# Altium project PT1000_16CH.PrjPCB (part 5 of 5)

## Sheet Adapters.SchDoc: various
size 420 x 297 mm; Author: G.Kasprowicz; CompanyName: WUT ISE; DrawnBy: G.Kasprowicz; Organization: WUT ISE; Address1: PW ISE; Address2: Nowowiejska 15/19 00-665 Warsaw; Address3: gkasprow@gmail.com; DocumentNumber: 5; Revision: 2; SheetNumber: 5; SheetTotal: 5; ModifiedBy: -; CheckedDate: -; Title2: adapters; DivGrp: WUT ISE; Designer: G.Kasprowicz; ModifiedDate: -; ProjectName: Sensor Box
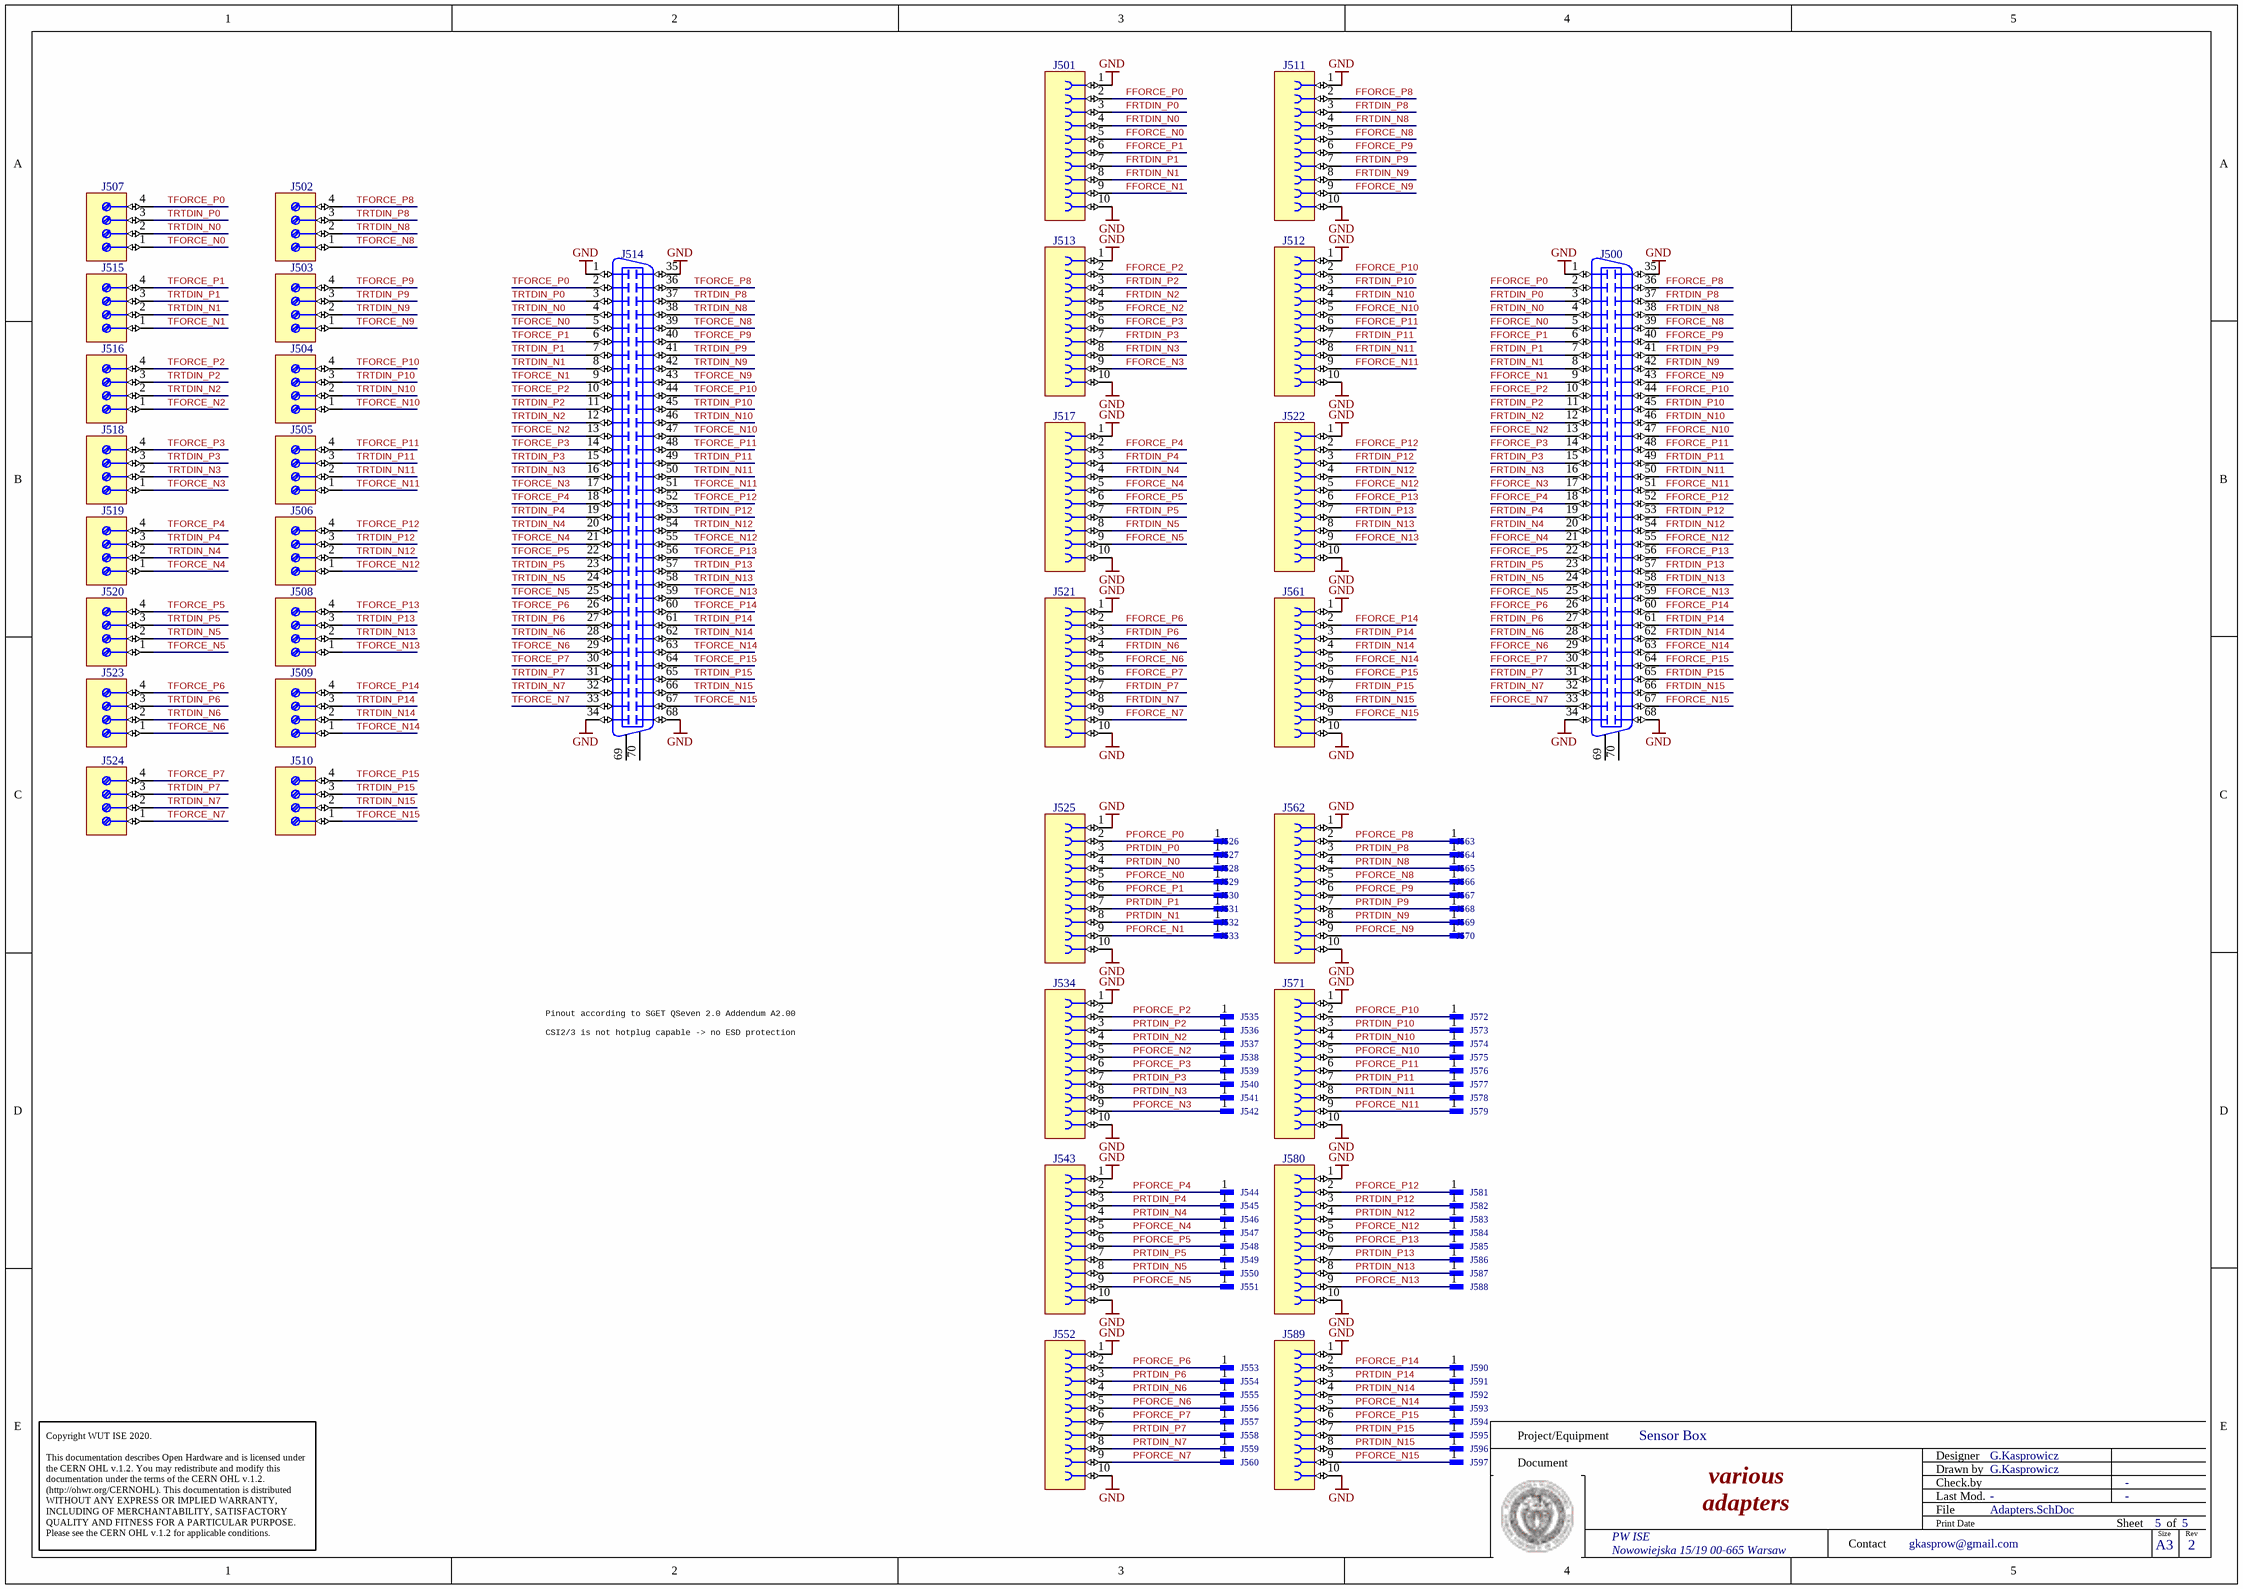
[diagram p7: Adapters.SchDoc]

### Parts
J500  DNP  [MOLEX_71430-0013]  (value not drawn)
J501  FFC/FPC  [MOLEX_52745-1097]  (value not drawn)
J502  (no value)  [PHOENIX_1725672]
J503  (no value)  [PHOENIX_1725672]
J504  (no value)  [PHOENIX_1725672]
J505  (no value)  [PHOENIX_1725672]
J506  (no value)  [PHOENIX_1725672]
J507  (no value)  [PHOENIX_1725672]
J508  (no value)  [PHOENIX_1725672]
J509  (no value)  [PHOENIX_1725672]
J510  (no value)  [PHOENIX_1725672]
J511  FFC/FPC  [MOLEX_52745-1097]  (value not drawn)
J512  FFC/FPC  [MOLEX_52745-1097]  (value not drawn)
J513  FFC/FPC  [MOLEX_52745-1097]  (value not drawn)
J514  DNP  [MOLEX_71430-0013]  (value not drawn)
J515  (no value)  [PHOENIX_1725672]
J516  (no value)  [PHOENIX_1725672]
J517  FFC/FPC  [MOLEX_52745-1097]  (value not drawn)
J518  (no value)  [PHOENIX_1725672]
J519  (no value)  [PHOENIX_1725672]
J520  (no value)  [PHOENIX_1725672]
J521  FFC/FPC  [MOLEX_52745-1097]  (value not drawn)
J522  FFC/FPC  [MOLEX_52745-1097]  (value not drawn)
J523  (no value)  [PHOENIX_1725672]
J524  (no value)  [PHOENIX_1725672]
J525  FFC/FPC  [MOLEX_52745-1097]  (value not drawn)
J526  SMD Pad  [R350X200]  (value not drawn)
J527  SMD Pad  [R350X200]  (value not drawn)
J528  SMD Pad  [R350X200]  (value not drawn)
J529  SMD Pad  [R350X200]  (value not drawn)
J530  SMD Pad  [R350X200]  (value not drawn)
J531  SMD Pad  [R350X200]  (value not drawn)
J532  SMD Pad  [R350X200]  (value not drawn)
J533  SMD Pad  [R350X200]  (value not drawn)
J534  FFC/FPC  [MOLEX_52745-1097]  (value not drawn)
J535  SMD Pad  [R350X200]  (value not drawn)
J536  SMD Pad  [R350X200]  (value not drawn)
J537  SMD Pad  [R350X200]  (value not drawn)
J538  SMD Pad  [R350X200]  (value not drawn)
J539  SMD Pad  [R350X200]  (value not drawn)
J540  SMD Pad  [R350X200]  (value not drawn)
J541  SMD Pad  [R350X200]  (value not drawn)
J542  SMD Pad  [R350X200]  (value not drawn)
J543  FFC/FPC  [MOLEX_52745-1097]  (value not drawn)
J544  SMD Pad  [R350X200]  (value not drawn)
J545  SMD Pad  [R350X200]  (value not drawn)
J546  SMD Pad  [R350X200]  (value not drawn)
J547  SMD Pad  [R350X200]  (value not drawn)
J548  SMD Pad  [R350X200]  (value not drawn)
J549  SMD Pad  [R350X200]  (value not drawn)
J550  SMD Pad  [R350X200]  (value not drawn)
J551  SMD Pad  [R350X200]  (value not drawn)
J552  FFC/FPC  [MOLEX_52745-1097]  (value not drawn)
J553  SMD Pad  [R350X200]  (value not drawn)
J554  SMD Pad  [R350X200]  (value not drawn)
J555  SMD Pad  [R350X200]  (value not drawn)
J556  SMD Pad  [R350X200]  (value not drawn)
J557  SMD Pad  [R350X200]  (value not drawn)
J558  SMD Pad  [R350X200]  (value not drawn)
J559  SMD Pad  [R350X200]  (value not drawn)
J560  SMD Pad  [R350X200]  (value not drawn)
J561  FFC/FPC  [MOLEX_52745-1097]  (value not drawn)
J562  FFC/FPC  [MOLEX_52745-1097]  (value not drawn)
J563  SMD Pad  [R350X200]  (value not drawn)
J564  SMD Pad  [R350X200]  (value not drawn)
J565  SMD Pad  [R350X200]  (value not drawn)
J566  SMD Pad  [R350X200]  (value not drawn)
J567  SMD Pad  [R350X200]  (value not drawn)
J568  SMD Pad  [R350X200]  (value not drawn)
J569  SMD Pad  [R350X200]  (value not drawn)
J570  SMD Pad  [R350X200]  (value not drawn)
J571  FFC/FPC  [MOLEX_52745-1097]  (value not drawn)
J572  SMD Pad  [R350X200]  (value not drawn)
J573  SMD Pad  [R350X200]  (value not drawn)
J574  SMD Pad  [R350X200]  (value not drawn)
J575  SMD Pad  [R350X200]  (value not drawn)
J576  SMD Pad  [R350X200]  (value not drawn)
J577  SMD Pad  [R350X200]  (value not drawn)
J578  SMD Pad  [R350X200]  (value not drawn)
J579  SMD Pad  [R350X200]  (value not drawn)
J580  FFC/FPC  [MOLEX_52745-1097]  (value not drawn)
J581  SMD Pad  [R350X200]  (value not drawn)
J582  SMD Pad  [R350X200]  (value not drawn)
J583  SMD Pad  [R350X200]  (value not drawn)
J584  SMD Pad  [R350X200]  (value not drawn)
J585  SMD Pad  [R350X200]  (value not drawn)
J586  SMD Pad  [R350X200]  (value not drawn)
J587  SMD Pad  [R350X200]  (value not drawn)
J588  SMD Pad  [R350X200]  (value not drawn)
J589  FFC/FPC  [MOLEX_52745-1097]  (value not drawn)
J590  SMD Pad  [R350X200]  (value not drawn)
J591  SMD Pad  [R350X200]  (value not drawn)
J592  SMD Pad  [R350X200]  (value not drawn)
J593  SMD Pad  [R350X200]  (value not drawn)
J594  SMD Pad  [R350X200]  (value not drawn)
J595  SMD Pad  [R350X200]  (value not drawn)
J596  SMD Pad  [R350X200]  (value not drawn)
J597  SMD Pad  [R350X200]  (value not drawn)

### Nets
GND: J500.1 J500.34 J500.35 J500.68 J501.1 J501.10 J511.1 J511.10 J512.1 J512.10 J513.1 J513.10 J514.1 J514.34 J514.35 J514.68 J517.1 J517.10 J521.1 J521.10 J522.1 J522.10 J525.1 J525.10 J534.1 J534.10 J543.1 J543.10 J552.1 J552.10 J561.1 J561.10 J562.1 J562.10 J571.1 J571.10 J580.1 J580.10 J589.1 J589.10
FFORCE_N0: J500.5 J501.5
FFORCE_N1: J500.9 J501.9
FFORCE_N2: J500.13 J513.5
FFORCE_N3: J500.17 J513.9
FFORCE_N4: J500.21 J517.5
FFORCE_N5: J500.25 J517.9
FFORCE_N6: J500.29 J521.5
FFORCE_N7: J500.33 J521.9
FFORCE_N8: J500.39 J511.5
FFORCE_N9: J500.43 J511.9
FFORCE_N10: J500.47 J512.5
FFORCE_N11: J500.51 J512.9
FFORCE_N12: J500.55 J522.5
FFORCE_N13: J500.59 J522.9
FFORCE_N14: J500.63 J561.5
FFORCE_N15: J500.67 J561.9
FFORCE_P0: J500.2 J501.2
FFORCE_P1: J500.6 J501.6
FFORCE_P2: J500.10 J513.2
FFORCE_P3: J500.14 J513.6
FFORCE_P4: J500.18 J517.2
FFORCE_P5: J500.22 J517.6
FFORCE_P6: J500.26 J521.2
FFORCE_P7: J500.30 J521.6
FFORCE_P8: J500.36 J511.2
FFORCE_P9: J500.40 J511.6
FFORCE_P10: J500.44 J512.2
FFORCE_P11: J500.48 J512.6
FFORCE_P12: J500.52 J522.2
FFORCE_P13: J500.56 J522.6
FFORCE_P14: J500.60 J561.2
FFORCE_P15: J500.64 J561.6
FRTDIN_N0: J500.4 J501.4
FRTDIN_N1: J500.8 J501.8
FRTDIN_N2: J500.12 J513.4
FRTDIN_N3: J500.16 J513.8
FRTDIN_N4: J500.20 J517.4
FRTDIN_N5: J500.24 J517.8
FRTDIN_N6: J500.28 J521.4
FRTDIN_N7: J500.32 J521.8
FRTDIN_N8: J500.38 J511.4
FRTDIN_N9: J500.42 J511.8
FRTDIN_N10: J500.46 J512.4
FRTDIN_N11: J500.50 J512.8
FRTDIN_N12: J500.54 J522.4
FRTDIN_N13: J500.58 J522.8
FRTDIN_N14: J500.62 J561.4
FRTDIN_N15: J500.66 J561.8
FRTDIN_P0: J500.3 J501.3
FRTDIN_P1: J500.7 J501.7
FRTDIN_P2: J500.11 J513.3
FRTDIN_P3: J500.15 J513.7
FRTDIN_P4: J500.19 J517.3
FRTDIN_P5: J500.23 J517.7
FRTDIN_P6: J500.27 J521.3
FRTDIN_P7: J500.31 J521.7
FRTDIN_P8: J500.37 J511.3
FRTDIN_P9: J500.41 J511.7
FRTDIN_P10: J500.45 J512.3
FRTDIN_P11: J500.49 J512.7
FRTDIN_P12: J500.53 J522.3
FRTDIN_P13: J500.57 J522.7
FRTDIN_P14: J500.61 J561.3
FRTDIN_P15: J500.65 J561.7
PFORCE_N0: J525.5 J529.1
PFORCE_N1: J525.9 J533.1
PFORCE_N2: J534.5 J538.1
PFORCE_N3: J534.9 J542.1
PFORCE_N4: J543.5 J547.1
PFORCE_N5: J543.9 J551.1
PFORCE_N6: J552.5 J556.1
PFORCE_N7: J552.9 J560.1
PFORCE_N8: J562.5 J566.1
PFORCE_N9: J562.9 J570.1
PFORCE_N10: J571.5 J575.1
PFORCE_N11: J571.9 J579.1
PFORCE_N12: J580.5 J584.1
PFORCE_N13: J580.9 J588.1
PFORCE_N14: J589.5 J593.1
PFORCE_N15: J589.9 J597.1
PFORCE_P0: J525.2 J526.1
PFORCE_P1: J525.6 J530.1
PFORCE_P2: J534.2 J535.1
PFORCE_P3: J534.6 J539.1
PFORCE_P4: J543.2 J544.1
PFORCE_P5: J543.6 J548.1
PFORCE_P6: J552.2 J553.1
PFORCE_P7: J552.6 J557.1
PFORCE_P8: J562.2 J563.1
PFORCE_P9: J562.6 J567.1
PFORCE_P10: J571.2 J572.1
PFORCE_P11: J571.6 J576.1
PFORCE_P12: J580.2 J581.1
PFORCE_P13: J580.6 J585.1
PFORCE_P14: J589.2 J590.1
PFORCE_P15: J589.6 J594.1
PRTDIN_N0: J525.4 J528.1
PRTDIN_N1: J525.8 J532.1
PRTDIN_N2: J534.4 J537.1
PRTDIN_N3: J534.8 J541.1
PRTDIN_N4: J543.4 J546.1
PRTDIN_N5: J543.8 J550.1
PRTDIN_N6: J552.4 J555.1
PRTDIN_N7: J552.8 J559.1
PRTDIN_N8: J562.4 J565.1
PRTDIN_N9: J562.8 J569.1
PRTDIN_N10: J571.4 J574.1
PRTDIN_N11: J571.8 J578.1
PRTDIN_N12: J580.4 J583.1
PRTDIN_N13: J580.8 J587.1
PRTDIN_N14: J589.4 J592.1
PRTDIN_N15: J589.8 J596.1
PRTDIN_P0: J525.3 J527.1
PRTDIN_P1: J525.7 J531.1
PRTDIN_P2: J534.3 J536.1
PRTDIN_P3: J534.7 J540.1
PRTDIN_P4: J543.3 J545.1
PRTDIN_P5: J543.7 J549.1
PRTDIN_P6: J552.3 J554.1
PRTDIN_P7: J552.7 J558.1
PRTDIN_P8: J562.3 J564.1
PRTDIN_P9: J562.7 J568.1
PRTDIN_P10: J571.3 J573.1
PRTDIN_P11: J571.7 J577.1
PRTDIN_P12: J580.3 J582.1
PRTDIN_P13: J580.7 J586.1
PRTDIN_P14: J589.3 J591.1
PRTDIN_P15: J589.7 J595.1
TFORCE_N0: J507.1 J514.5
TFORCE_N1: J514.9 J515.1
TFORCE_N2: J514.13 J516.1
TFORCE_N3: J514.17 J518.1
TFORCE_N4: J514.21 J519.1
TFORCE_N5: J514.25 J520.1
TFORCE_N6: J514.29 J523.1
TFORCE_N7: J514.33 J524.1
TFORCE_N8: J502.1 J514.39
TFORCE_N9: J503.1 J514.43
TFORCE_N10: J504.1 J514.47
TFORCE_N11: J505.1 J514.51
TFORCE_N12: J506.1 J514.55
TFORCE_N13: J508.1 J514.59
TFORCE_N14: J509.1 J514.63
TFORCE_N15: J510.1 J514.67
TFORCE_P0: J507.4 J514.2
TFORCE_P1: J514.6 J515.4
TFORCE_P2: J514.10 J516.4
TFORCE_P3: J514.14 J518.4
TFORCE_P4: J514.18 J519.4
TFORCE_P5: J514.22 J520.4
TFORCE_P6: J514.26 J523.4
TFORCE_P7: J514.30 J524.4
TFORCE_P8: J502.4 J514.36
TFORCE_P9: J503.4 J514.40
TFORCE_P10: J504.4 J514.44
TFORCE_P11: J505.4 J514.48
TFORCE_P12: J506.4 J514.52
TFORCE_P13: J508.4 J514.56
TFORCE_P14: J509.4 J514.60
TFORCE_P15: J510.4 J514.64
TRTDIN_N0: J507.2 J514.4
TRTDIN_N1: J514.8 J515.2
TRTDIN_N2: J514.12 J516.2
TRTDIN_N3: J514.16 J518.2
TRTDIN_N4: J514.20 J519.2
TRTDIN_N5: J514.24 J520.2
TRTDIN_N6: J514.28 J523.2
TRTDIN_N7: J514.32 J524.2
TRTDIN_N8: J502.2 J514.38
TRTDIN_N9: J503.2 J514.42
TRTDIN_N10: J504.2 J514.46
TRTDIN_N11: J505.2 J514.50
TRTDIN_N12: J506.2 J514.54
TRTDIN_N13: J508.2 J514.58
TRTDIN_N14: J509.2 J514.62
TRTDIN_N15: J510.2 J514.66
TRTDIN_P0: J507.3 J514.3
TRTDIN_P1: J514.7 J515.3
TRTDIN_P2: J514.11 J516.3
TRTDIN_P3: J514.15 J518.3
TRTDIN_P4: J514.19 J519.3
TRTDIN_P5: J514.23 J520.3
TRTDIN_P6: J514.27 J523.3
TRTDIN_P7: J514.31 J524.3
TRTDIN_P8: J502.3 J514.37
TRTDIN_P9: J503.3 J514.41
TRTDIN_P10: J504.3 J514.45
TRTDIN_P11: J505.3 J514.49
TRTDIN_P12: J506.3 J514.53
TRTDIN_P13: J508.3 J514.57
TRTDIN_P14: J509.3 J514.61
TRTDIN_P15: J510.3 J514.65

Not connected (* = marked no-connect by the designer): J500 69 70; J514 69 70

### Notes on the sheet
- Pinout according to SGET QSeven 2.0 Addendum A2.00
  CSI2/3 is not hotplug capable -> no ESD protection
- Project/Equipment
- Document
- Designer
- Drawn by
- Check.by
- Copyright WUT ISE 2020.
  This documentation describes Open Hardware and is licensed under the CERN OHL v.1.2. You may redistribute and modify this documentation under the terms of the CERN OHL v.1.2. (http://ohwr.org/CERNOHL). This documentation is distributed WITHOUT ANY EXPRESS OR IMPLIED WARRANTY, INCLUDING OF MERCHANTABILITY, SATISFACTORY QUALITY AND FITNESS FOR A PARTICULAR PURPOSE. Please see the CERN OHL v.1.2 for applicable conditions.
- Contact
- File
- Last Mod.
- Print Date
- Sheet
- Size
- A3
- of
- Rev

### Library data of the parts
J500 J514 = MOLEX_71430-0013: Very High Density Cable Interconnect (VHDCI ) 68 Female; Part Description: 68 Positions, Pitch 0.8mm, Very Hight Density Right Angle Receptacle, VHDCI Standard (Recommended PCB Thickness: 1.6mm); Manufacturer: MOLEX; PressFit: No; Part Number: MOLEX_71430-0013; Component Kind: Standard; Component Type: Standard; Pin Count: 70; Family: VHDCI; Mounted: Yes; Socket: No; SMD: No; Status: None; Manufacturer Part Number: 71430-0013; ComponentHeight: 6.28mm; HelpURL: \\cern.ch\dfs\Applications\Altium\Datasheets\MOLEX_71430-0013.pdf; Author: CERN DEM JLC; CreateDate: 2014-01-30; LatestRevisionDate: 2014-01-30; Table: MOLEX
J501 J511-J513 J517 J521 J522 J525 J534 J543 J552 J561 J562 J571 J580 J589 = MOLEX_52745-1097: Connector 10 Female; Part Description: 10 Contacts, 0.5mm Pitch, Right Angled Surface Mount FFC/FPC Connector, ZIF, Top Contact Style; Manufacturer: MOLEX; PressFit: No; Part Number: MOLEX_52745-1097; Component Kind: Standard; Component Type: Standard; Pin Count: 10; Family: FFC/FPC; Mounted: Yes; Socket: No; SMD: Yes; Sense: No; Status: None; Manufacturer Part Number: 52745-1097; ComponentHeight: 2mm; HelpURL: \\cern.ch\dfs\Applications\Altium\Datasheets\MOLEX_52745-1097.pdf; Author: CERN DEM JLC; CreateDate: 04/11/2014; LatestRevisionDate: 05/12/2014
J502-J510 J515 J516 J518-J520 J523 J524 = PHOENIX_1725672: Terminal Block, 4 Positions, Screw Connection; Part Description: 6A, 63V, Terminal Block, Pitch 2.54mm, 4 Positions, Screw Connection; Manufacturer: PHOENIX CONTACT; Manufacturer Part Number: 1725672 (MPT 0,5/4-2,54); PressFit: No; Part Number: PHOENIX_1725672; Component Kind: Standard; Component Type: Standard; Pin Count: 4; Mounted: Yes; Socket: No; SMD: No; Sense: No; Status: None; ComponentHeight: 8.5mm; HelpURL: \\cern.ch\dfs\Applications\Altium\Datasheets\PHOENIX_1725672.pdf; Author: CERN DEM JMW; CreateDate: 07.11.2008; LatestRevisionDate: 26.04.2010
J526-J533 J535-J542 J544-J551 J553-J560 J563-J570 J572-J579 J581-J588 J590-J597 = SMD_PAD_3.5X2MM: Single SMD Pad; Part Description: 3.5mm x 2mm SMD Pad; Mounted: No; Part Number: SMD_PAD_3.5X2MM; Component Kind: Standard (No BOM); Component Type: Standard (No BOM); Pin Count: 1; Family: SMD Pad; Socket: No; SMD: No; Sense: No; Status: None; ComponentHeight: 0mm; HelpURL: Undefined; Author: CERN DEM JLC; CreateDate: 15/03/2010; LatestRevisionDate: 15/03/2010; PackageDescription: 3.5mm x  2mm SMD Pad

## Nets that join several sheets
5V0_USB: USB (F1.2), Supply (D?#1.2)
GND: Thermostat_16CH (11 pins), MCU_STM32F4 (62 pins), RMII_Ethernet (24 pins), USB (11 pins), Supply (37 pins), EEM_DIOT_connector (61 pins), RTD_00 (8 pins), RTD_01 (8 pins), RTD_02 (8 pins), RTD_03 (8 pins), RTD_04 (8 pins), RTD_05 (8 pins), RTD_06 (8 pins), RTD_07 (8 pins), RTD_08 (8 pins), RTD_09 (8 pins), RTD_10 (8 pins), RTD_11 (8 pins), RTD_12 (8 pins), RTD_13 (8 pins), RTD_14 (8 pins), RTD_15 (8 pins), Adapters (40 pins)
P3V0REF: MCU_STM32F4 (R70.2), Supply (5 pins)
P3V3: Thermostat_16CH (D3.5 IC7.6 IC7.16 IC8.16), MCU_STM32F4 (48 pins), RMII_Ethernet (8 pins), Supply (10 pins), EEM_DIOT_connector (19 pins), RTD_00 (C224_1.1 C225_1.1 IC84_1.19 L2_1.2), RTD_01 (C224_2.1 C225_2.1 IC84_2.19 L2_2.2), RTD_02 (C224_3.1 C225_3.1 IC84_3.19 L2_3.2), RTD_03 (C224_4.1 C225_4.1 IC84_4.19 L2_4.2), RTD_04 (C224_5.1 C225_5.1 IC84_5.19 L2_5.2), RTD_05 (C224_6.1 C225_6.1 IC84_6.19 L2_6.2), RTD_06 (C224_7.1 C225_7.1 IC84_7.19 L2_7.2), RTD_07 (C224_8.1 C225_8.1 IC84_8.19 L2_8.2), RTD_08 (C224_9.1 C225_9.1 IC84_9.19 L2_9.2), RTD_09 (C224_10.1 C225_10.1 IC84_10.19 L2_10.2), RTD_10 (C224_11.1 C225_11.1 IC84_11.19 L2_11.2), RTD_11 (C224_12.1 C225_12.1 IC84_12.19 L2_12.2), RTD_12 (C224_13.1 C225_13.1 IC84_13.19 L2_13.2), RTD_13 (C224_14.1 C225_14.1 IC84_14.19 L2_14.2), RTD_14 (C224_15.1 C225_15.1 IC84_15.19 L2_15.2), RTD_15 (C224_16.1 C225_16.1 IC84_16.19 L2_16.2)
P3V3_MP: Supply (R10.1), EEM_DIOT_connector (10 pins)
P12V0: MCU_STM32F4 (R83.2), Supply (6 pins), EEM_DIOT_connector (7 pins)
P12V0_IN: Supply (11 pins), EEM_DIOT_connector (T9.1 T9.2 T9.3 T10.1)
AFE_SCL: Thermostat_16CH (D3.3 J1.68), MCU_STM32F4 (B15.1 IC9.11 R61.2)
AFE_SDA: Thermostat_16CH (D3.4 J1.34), MCU_STM32F4 (B14.1 IC9.10 R53.2)
AT_EVENT: MCU_STM32F4 (IC9.66), Supply (IC6.4 R67.1)
CPU_RESETn: MCU_STM32F4 (D5.1 IC13.2), Supply (T6.1)
FORCE_N00: Thermostat_16CH (J1.5), RTD_00 (IC84_1.9)
FORCE_N01: Thermostat_16CH (J1.9), RTD_01 (IC84_2.9)
FORCE_N02: Thermostat_16CH (J1.13), RTD_02 (IC84_3.9)
FORCE_N03: Thermostat_16CH (J1.17), RTD_03 (IC84_4.9)
FORCE_N04: Thermostat_16CH (J1.21), RTD_04 (IC84_5.9)
FORCE_N05: Thermostat_16CH (J1.25), RTD_05 (IC84_6.9)
FORCE_N06: Thermostat_16CH (J1.29), RTD_06 (IC84_7.9)
FORCE_N07: Thermostat_16CH (J1.33), RTD_07 (IC84_8.9)
FORCE_N08: Thermostat_16CH (J1.39), RTD_08 (IC84_9.9)
FORCE_N09: Thermostat_16CH (J1.43), RTD_09 (IC84_10.9)
FORCE_N10: Thermostat_16CH (J1.47), RTD_10 (IC84_11.9)
FORCE_N11: Thermostat_16CH (J1.51), RTD_11 (IC84_12.9)
FORCE_N12: Thermostat_16CH (J1.55), RTD_12 (IC84_13.9)
FORCE_N13: Thermostat_16CH (J1.59), RTD_13 (IC84_14.9)
FORCE_N14: Thermostat_16CH (J1.63), RTD_14 (IC84_15.9)
FORCE_N15: Thermostat_16CH (J1.67), RTD_15 (IC84_16.9)
FORCE_P00: Thermostat_16CH (J1.2), RTD_00 (IC84_1.5)
FORCE_P01: Thermostat_16CH (J1.6), RTD_01 (IC84_2.5)
FORCE_P02: Thermostat_16CH (J1.10), RTD_02 (IC84_3.5)
FORCE_P03: Thermostat_16CH (J1.14), RTD_03 (IC84_4.5)
FORCE_P04: Thermostat_16CH (J1.18), RTD_04 (IC84_5.5)
FORCE_P05: Thermostat_16CH (J1.22), RTD_05 (IC84_6.5)
FORCE_P06: Thermostat_16CH (J1.26), RTD_06 (IC84_7.5)
FORCE_P07: Thermostat_16CH (J1.30), RTD_07 (IC84_8.5)
FORCE_P08: Thermostat_16CH (J1.36), RTD_08 (IC84_9.5)
FORCE_P09: Thermostat_16CH (J1.40), RTD_09 (IC84_10.5)
FORCE_P10: Thermostat_16CH (J1.44), RTD_10 (IC84_11.5)
FORCE_P11: Thermostat_16CH (J1.48), RTD_11 (IC84_12.5)
FORCE_P12: Thermostat_16CH (J1.52), RTD_12 (IC84_13.5)
FORCE_P13: Thermostat_16CH (J1.56), RTD_13 (IC84_14.5)
FORCE_P14: Thermostat_16CH (J1.60), RTD_14 (IC84_15.5)
FORCE_P15: Thermostat_16CH (J1.64), RTD_15 (IC84_16.5)
I2C1_SCL: MCU_STM32F4 (IC9.139), EEM_DIOT_connector (5 pins)
I2C1_SDA: MCU_STM32F4 (IC9.140), EEM_DIOT_connector (5 pins)
I_meas_P12V0: MCU_STM32F4 (IC9.20), Supply (C89.1 R141.2)
MAX_CH_A0: Thermostat_16CH (IC7.1 IC8.1 R42.1), MCU_STM32F4 (IC9.141)
MAX_CH_A1: Thermostat_16CH (IC7.2 IC8.2 R43.1), MCU_STM32F4 (IC9.142)
MAX_CH_A2: Thermostat_16CH (IC7.3 IC8.3 R44.1), MCU_STM32F4 (IC9.1)
MAX_CH_A3: Thermostat_16CH (IC7.5 IC8.6 R46.1), MCU_STM32F4 (IC9.2)
MAX_CS00: Thermostat_16CH (IC7.15), RTD_00 (IC84_1.13)
MAX_CS01: Thermostat_16CH (IC7.14), RTD_01 (IC84_2.13)
MAX_CS02: Thermostat_16CH (IC7.13), RTD_02 (IC84_3.13)
MAX_CS03: Thermostat_16CH (IC7.12), RTD_03 (IC84_4.13)
MAX_CS04: Thermostat_16CH (IC7.11), RTD_04 (IC84_5.13)
MAX_CS05: Thermostat_16CH (IC7.10), RTD_05 (IC84_6.13)
MAX_CS06: Thermostat_16CH (IC7.9), RTD_06 (IC84_7.13)
MAX_CS07: Thermostat_16CH (IC7.7), RTD_07 (IC84_8.13)
MAX_CS08: Thermostat_16CH (IC8.15), RTD_08 (IC84_9.13)
MAX_CS09: Thermostat_16CH (IC8.14), RTD_09 (IC84_10.13)
MAX_CS10: Thermostat_16CH (IC8.13), RTD_10 (IC84_11.13)
MAX_CS11: Thermostat_16CH (IC8.12), RTD_11 (IC84_12.13)
MAX_CS12: Thermostat_16CH (IC8.11), RTD_12 (IC84_13.13)
MAX_CS13: Thermostat_16CH (IC8.10), RTD_13 (IC84_14.13)
MAX_CS14: Thermostat_16CH (IC8.9), RTD_14 (IC84_15.13)
MAX_CS15: Thermostat_16CH (IC8.7), RTD_15 (IC84_16.13)
NetIC9_56: MCU_STM32F4 (IC9.56), EEM_DIOT_connector (R117.1)
NetIC9_57: MCU_STM32F4 (IC9.57), EEM_DIOT_connector (R115.1)
NetIC9_69: MCU_STM32F4 (IC9.69), EEM_DIOT_connector (R110.1)
NetIC9_73: MCU_STM32F4 (IC9.73), EEM_DIOT_connector (R112.1)
NetIC9_75: MCU_STM32F4 (IC9.75), EEM_DIOT_connector (R113.1)
NetIC9_76: MCU_STM32F4 (IC9.76), EEM_DIOT_connector (R108.1)
NetIC9_87: MCU_STM32F4 (IC9.87), EEM_DIOT_connector (R118.1)
NetIC9_88: MCU_STM32F4 (IC9.88), EEM_DIOT_connector (R123.1)
NetIC9_114: MCU_STM32F4 (IC9.114), EEM_DIOT_connector (R197.2 T11.1)
PHY_NRST: MCU_STM32F4 (IC9.129), RMII_Ethernet (IC11.15 R125.2)
POE_PWR_SRC: MCU_STM32F4 (IC9.13), Supply (R30.1 R31.2)
POE_VC+: RMII_Ethernet (D7.1 D10.1 D11.1 D22.1), Supply (L1.1 R14.2)
POE_VC-: RMII_Ethernet (D6.2 D8.2 D9.2 D23.2), Supply (R35.1 R64.1 R66.1 T4.2)
RMII_CRS_DV: MCU_STM32F4 (IC9.43), RMII_Ethernet (R27.1)
RMII_MDC: MCU_STM32F4 (IC9.27), RMII_Ethernet (B16.1 IC11.13)
RMII_MDIO: MCU_STM32F4 (IC9.36), RMII_Ethernet (B17.1 IC11.12 R98.2)
RMII_REF_CLK: MCU_STM32F4 (IC9.35), RMII_Ethernet (R29.1)
RMII_RXD0: MCU_STM32F4 (IC9.44), RMII_Ethernet (R23.1)
RMII_RXD1: MCU_STM32F4 (IC9.45), RMII_Ethernet (R24.1)
RMII_TX_EN: MCU_STM32F4 (IC9.126), RMII_Ethernet (IC11.16)
RMII_TXD0: MCU_STM32F4 (IC9.128), RMII_Ethernet (IC11.17)
RMII_TXD1: MCU_STM32F4 (IC9.74), RMII_Ethernet (IC11.18)
RTDIN_N00: Thermostat_16CH (J1.4), RTD_00 (C156_1.2 IC84_1.8)
RTDIN_N01: Thermostat_16CH (J1.8), RTD_01 (C156_2.2 IC84_2.8)
RTDIN_N02: Thermostat_16CH (J1.12), RTD_02 (C156_3.2 IC84_3.8)
RTDIN_N03: Thermostat_16CH (J1.16), RTD_03 (C156_4.2 IC84_4.8)
RTDIN_N04: Thermostat_16CH (J1.20), RTD_04 (C156_5.2 IC84_5.8)
RTDIN_N05: Thermostat_16CH (J1.24), RTD_05 (C156_6.2 IC84_6.8)
RTDIN_N06: Thermostat_16CH (J1.28), RTD_06 (C156_7.2 IC84_7.8)
RTDIN_N07: Thermostat_16CH (J1.32), RTD_07 (C156_8.2 IC84_8.8)
RTDIN_N08: Thermostat_16CH (J1.38), RTD_08 (C156_9.2 IC84_9.8)
RTDIN_N09: Thermostat_16CH (J1.42), RTD_09 (C156_10.2 IC84_10.8)
RTDIN_N10: Thermostat_16CH (J1.46), RTD_10 (C156_11.2 IC84_11.8)
RTDIN_N11: Thermostat_16CH (J1.50), RTD_11 (C156_12.2 IC84_12.8)
RTDIN_N12: Thermostat_16CH (J1.54), RTD_12 (C156_13.2 IC84_13.8)
RTDIN_N13: Thermostat_16CH (J1.58), RTD_13 (C156_14.2 IC84_14.8)
RTDIN_N14: Thermostat_16CH (J1.62), RTD_14 (C156_15.2 IC84_15.8)
RTDIN_N15: Thermostat_16CH (J1.66), RTD_15 (C156_16.2 IC84_16.8)
RTDIN_P00: Thermostat_16CH (J1.3), RTD_00 (C156_1.1 IC84_1.7 R351_1.2)
RTDIN_P01: Thermostat_16CH (J1.7), RTD_01 (C156_2.1 IC84_2.7 R351_2.2)
RTDIN_P02: Thermostat_16CH (J1.11), RTD_02 (C156_3.1 IC84_3.7 R351_3.2)
RTDIN_P03: Thermostat_16CH (J1.15), RTD_03 (C156_4.1 IC84_4.7 R351_4.2)
RTDIN_P04: Thermostat_16CH (J1.19), RTD_04 (C156_5.1 IC84_5.7 R351_5.2)
RTDIN_P05: Thermostat_16CH (J1.23), RTD_05 (C156_6.1 IC84_6.7 R351_6.2)
RTDIN_P06: Thermostat_16CH (J1.27), RTD_06 (C156_7.1 IC84_7.7 R351_7.2)
RTDIN_P07: Thermostat_16CH (J1.31), RTD_07 (C156_8.1 IC84_8.7 R351_8.2)
RTDIN_P08: Thermostat_16CH (J1.37), RTD_08 (C156_9.1 IC84_9.7 R351_9.2)
RTDIN_P09: Thermostat_16CH (J1.41), RTD_09 (C156_10.1 IC84_10.7 R351_10.2)
RTDIN_P10: Thermostat_16CH (J1.45), RTD_10 (C156_11.1 IC84_11.7 R351_11.2)
RTDIN_P11: Thermostat_16CH (J1.49), RTD_11 (C156_12.1 IC84_12.7 R351_12.2)
RTDIN_P12: Thermostat_16CH (J1.53), RTD_12 (C156_13.1 IC84_13.7 R351_13.2)
RTDIN_P13: Thermostat_16CH (J1.57), RTD_13 (C156_14.1 IC84_14.7 R351_14.2)
RTDIN_P14: Thermostat_16CH (J1.61), RTD_14 (C156_15.1 IC84_15.7 R351_15.2)
RTDIN_P15: Thermostat_16CH (J1.65), RTD_15 (C156_16.1 IC84_16.7 R351_16.2)
SPI1_MISO: Thermostat_16CH (R38.1), MCU_STM32F4 (IC9.42), RTD_00 (IC84_1.14), RTD_01 (IC84_2.14), RTD_02 (IC84_3.14), RTD_03 (IC84_4.14), RTD_04 (IC84_5.14), RTD_05 (IC84_6.14), RTD_06 (IC84_7.14), RTD_07 (IC84_8.14), RTD_08 (IC84_9.14), RTD_09 (IC84_10.14), RTD_10 (IC84_11.14), RTD_11 (IC84_12.14), RTD_12 (IC84_13.14), RTD_13 (IC84_14.14), RTD_14 (IC84_15.14), RTD_15 (IC84_16.14)
SPI1_MOSI: Thermostat_16CH (R37.1), MCU_STM32F4 (IC9.135), RTD_00 (IC84_1.11), RTD_01 (IC84_2.11), RTD_02 (IC84_3.11), RTD_03 (IC84_4.11), RTD_04 (IC84_5.11), RTD_05 (IC84_6.11), RTD_06 (IC84_7.11), RTD_07 (IC84_8.11), RTD_08 (IC84_9.11), RTD_09 (IC84_10.11), RTD_10 (IC84_11.11), RTD_11 (IC84_12.11), RTD_12 (IC84_13.11), RTD_13 (IC84_14.11), RTD_14 (IC84_15.11), RTD_15 (IC84_16.11)
SPI1_NSS: Thermostat_16CH (IC7.4 IC8.4 IC8.5), MCU_STM32F4 (IC9.40)
SPI1_SCK: Thermostat_16CH (R41.1), MCU_STM32F4 (IC9.41), RTD_00 (IC84_1.12), RTD_01 (IC84_2.12), RTD_02 (IC84_3.12), RTD_03 (IC84_4.12), RTD_04 (IC84_5.12), RTD_05 (IC84_6.12), RTD_06 (IC84_7.12), RTD_07 (IC84_8.12), RTD_08 (IC84_9.12), RTD_09 (IC84_10.12), RTD_10 (IC84_11.12), RTD_11 (IC84_12.12), RTD_12 (IC84_13.12), RTD_13 (IC84_14.12), RTD_14 (IC84_15.12), RTD_15 (IC84_16.12)
USB_ID: MCU_STM32F4 (IC9.102), USB (C108.2 D21.1 FB2.1)
USB_N: MCU_STM32F4 (IC9.103), USB (D21.4 L9.2)
USB_P: MCU_STM32F4 (IC9.104), USB (D21.3 L9.3)
USB_VBUS: MCU_STM32F4 (R34.2), USB (R73.1 R75.1)

## Assembly variants
Default: all parts fitted